# Altium schematic sheet 17 USB3 CONTROLLER.SchDoc
size 594 x 420 mm
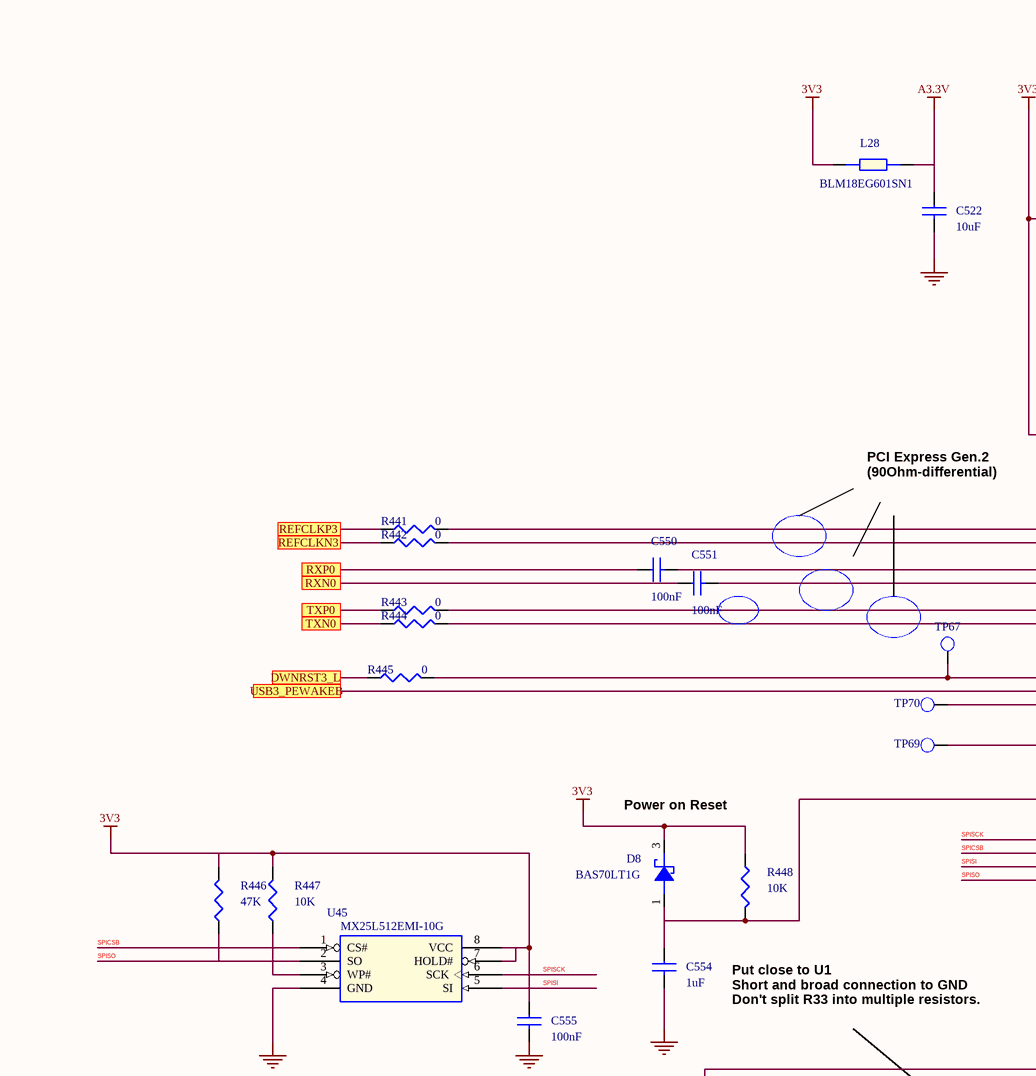
[diagram p0: 17 USB3 CONTROLLER.SchDoc, top left]
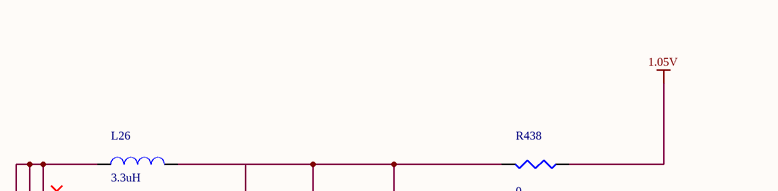
[diagram p1: 17 USB3 CONTROLLER.SchDoc, top right]
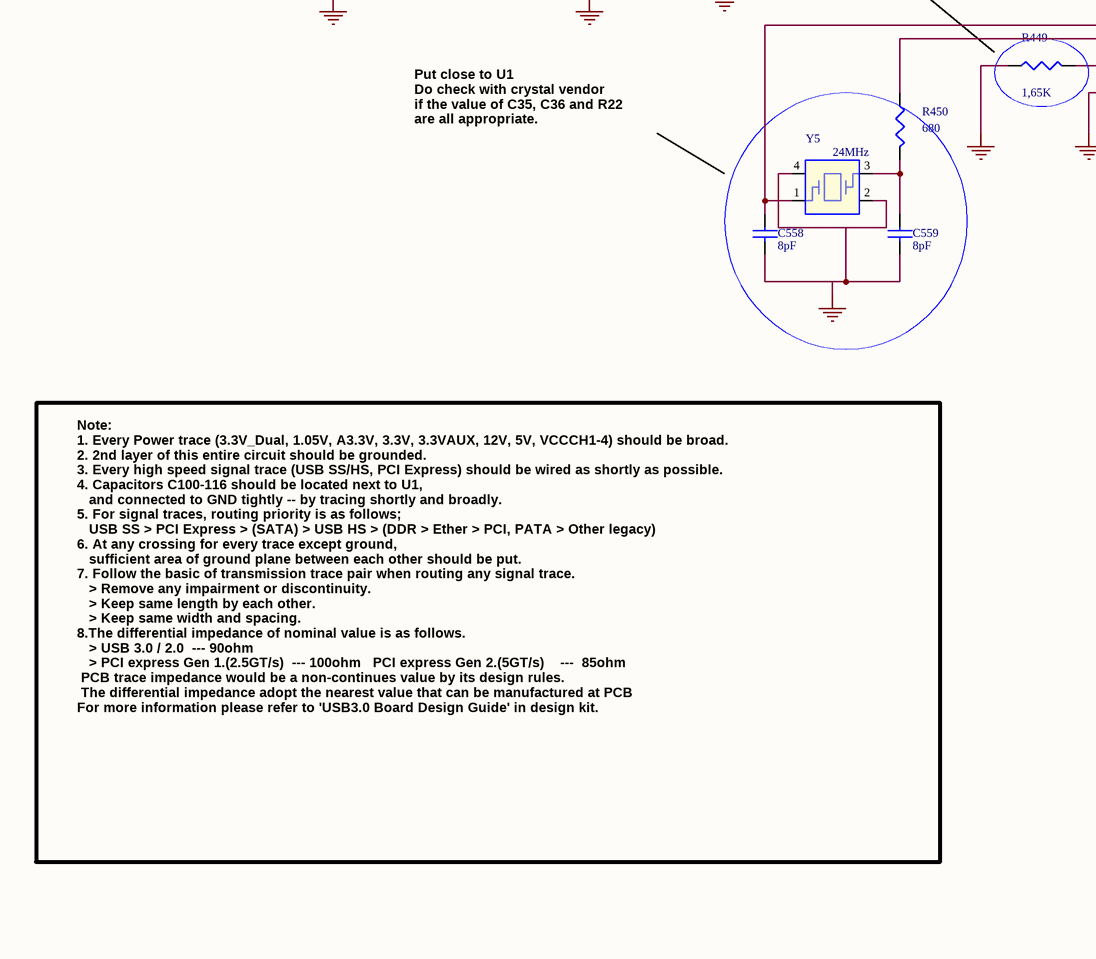
[diagram p2: 17 USB3 CONTROLLER.SchDoc, bottom left]
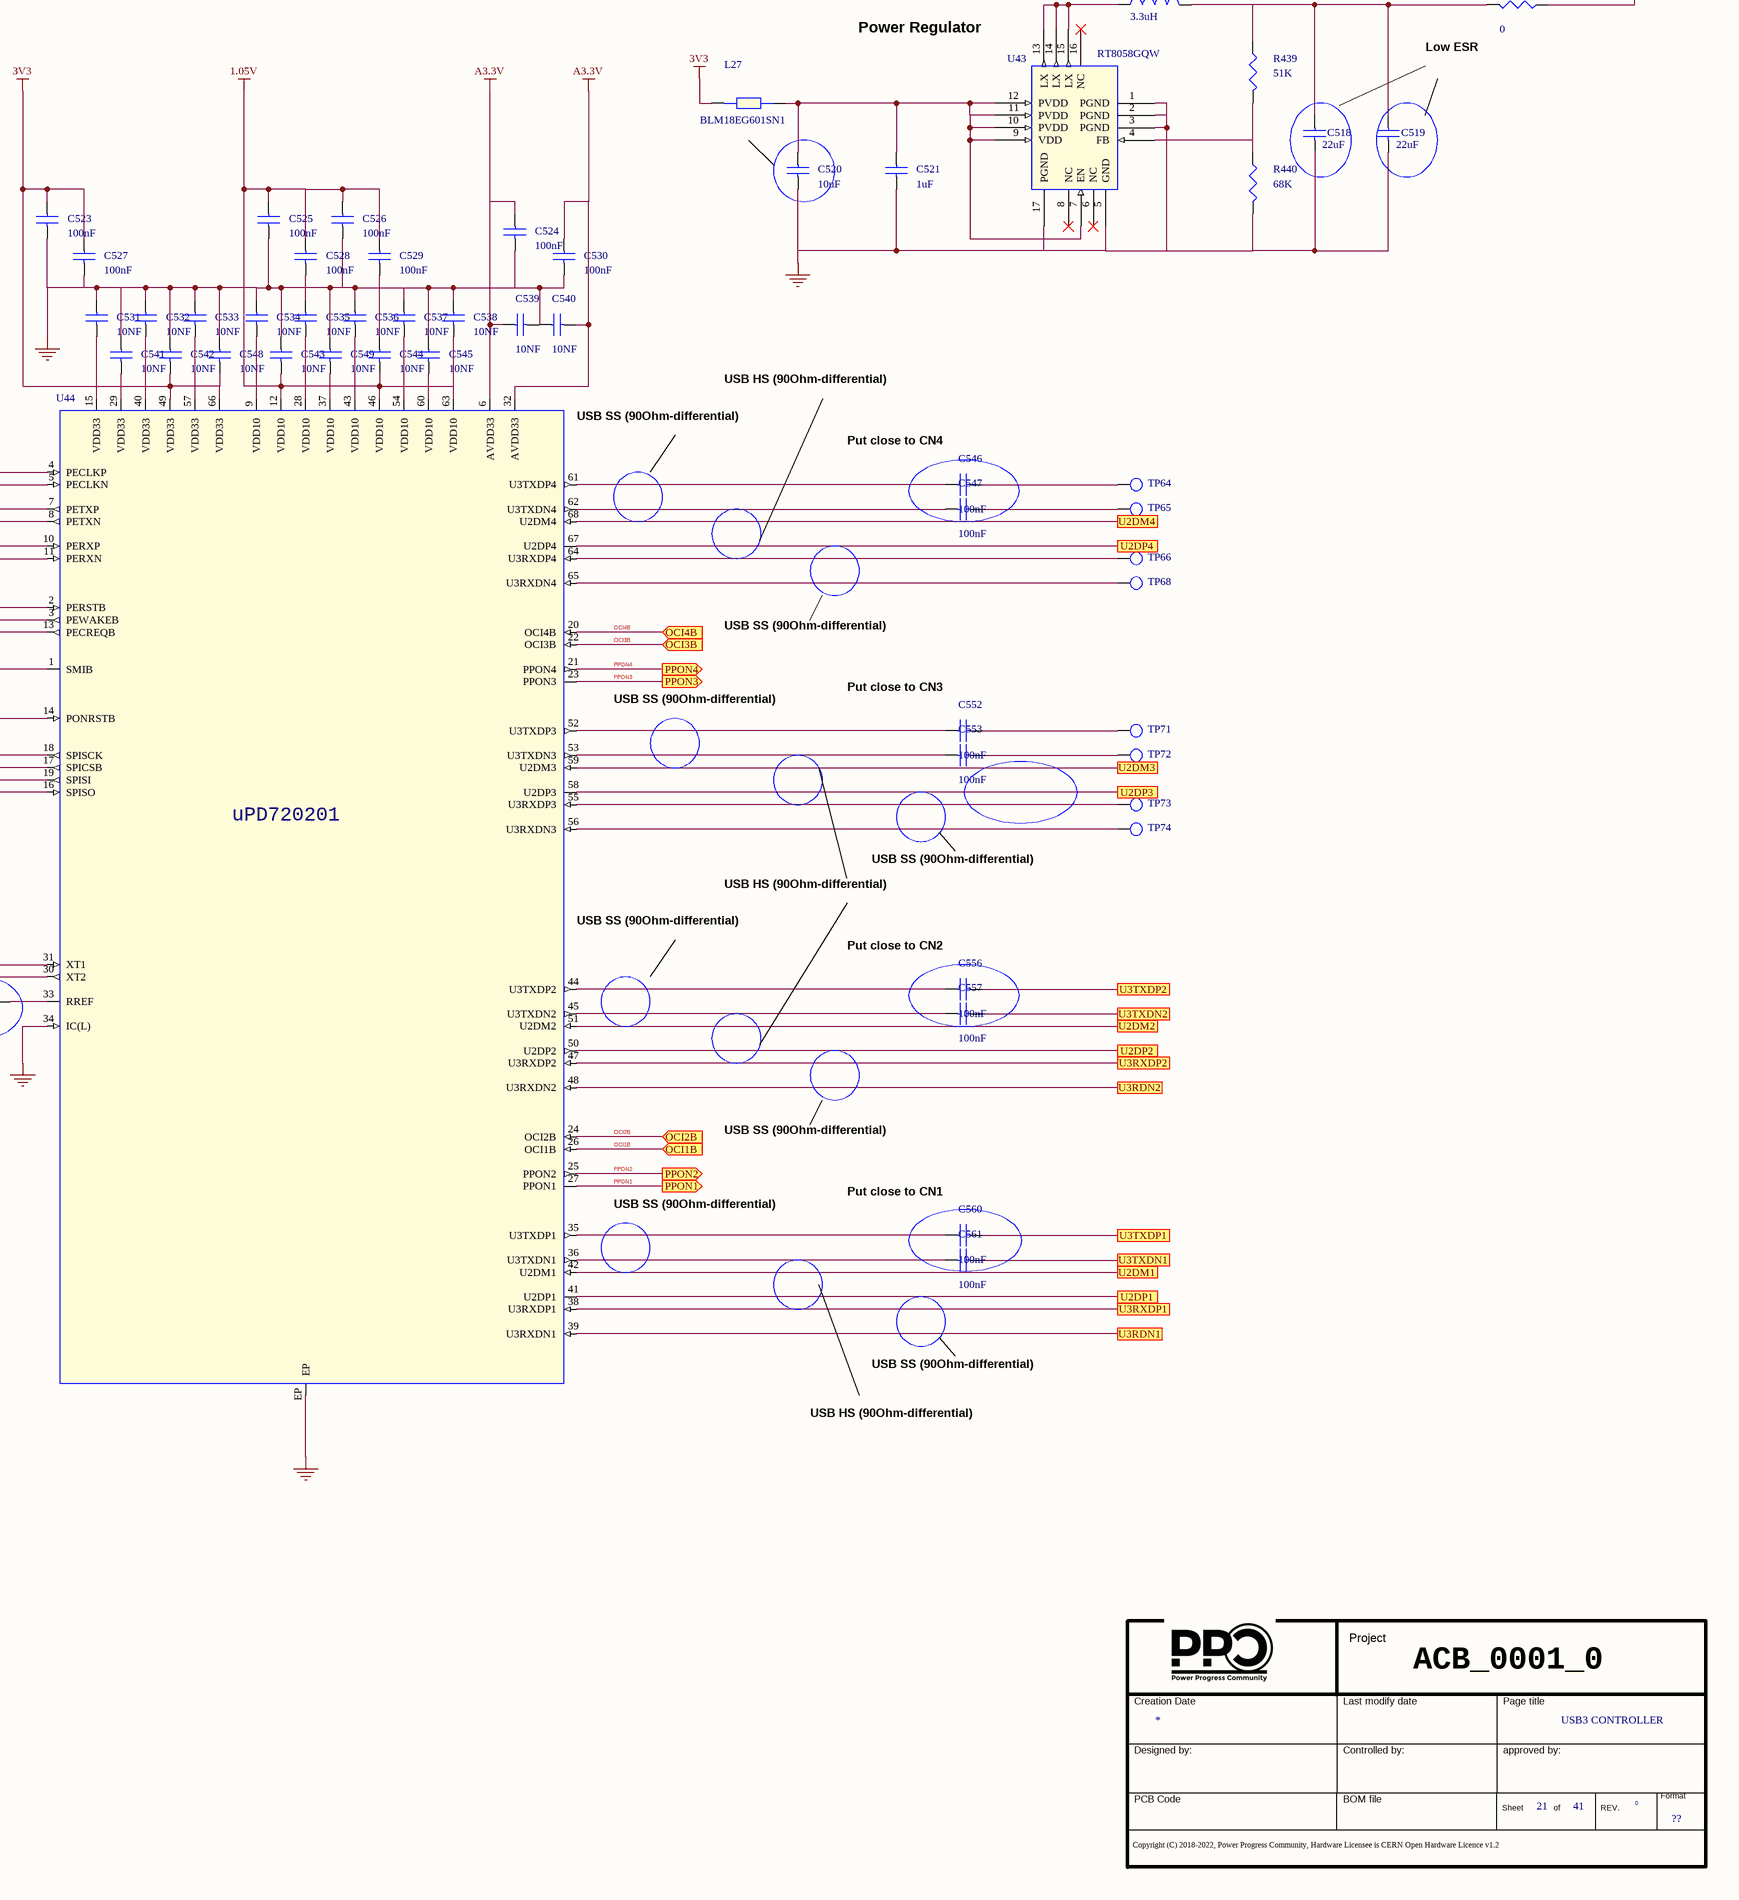
[diagram p3: 17 USB3 CONTROLLER.SchDoc, bottom right]

## Parts
*  Doc: USB3 CONTROLLER  Page Count: 41  Page Number: 21  Page Size: ??  RevCode: 0  (hidden comment: Title_block_PPC)  (graphical)
C518  22uF  [SMD_0805]
C519  22uF  [SMD_0805]
C520  10uF  [SMD_0603]
C521  1uF  [SMD_0402]
C522  10uF  [SMD_0603]
C523  100nF  [SMD_0402]
C524  100nF  [SMD_0402]
C525  100nF  [SMD_0402]
C526  100nF  [SMD_0402]
C527  100nF  [SMD_0402]
C528  100nF  [SMD_0402]
C529  100nF  [SMD_0402]
C530  100nF  [SMD_0402]
C531  10NF  [SMD_0402]
C532  10NF  [SMD_0402]
C533  10NF  [SMD_0402]
C534  10NF  [SMD_0402]
C535  10NF  [SMD_0402]
C536  10NF  [SMD_0402]
C537  10NF  [SMD_0402]
C538  10NF  [SMD_0402]
C539  10NF  [SMD_0402]
C540  10NF  [SMD_0402]
C541  10NF  [SMD_0402]
C542  10NF  [SMD_0402]
C543  10NF  [SMD_0402]
C544  10NF  [SMD_0402]
C545  10NF  [SMD_0402]
C546  100nF  [SMD_0402]
C547  100nF  [SMD_0402]
C548  10NF  [SMD_0402]
C549  10NF  [SMD_0402]
C550  100nF  [SMD_0402]
C551  100nF  [SMD_0402]
C552  100nF  [SMD_0402]
C553  100nF  [SMD_0402]
C554  1uF  [SMD_0402]
C555  100nF  [SMD_0603]
C556  100nF  [SMD_0402]
C557  100nF  [SMD_0402]
C558  8pF  [SMD_0402]
C559  8pF  [SMD_0402]
C560  100nF  [SMD_0402]
C561  100nF  [SMD_0402]
D8  BAS70LT1G  [SOT-23]
L26  3.3uH  [SMD_SRU1028]
L27  BLM18EG601SN1  [SMD_0603]
L28  BLM18EG601SN1  [SMD_0603]
R438  0  [SMD_1206]
R439  51K  [SMD_0402]
R440  68K  [SMD_0402]
R441  0  [SMD_0402]
R442  0  [SMD_0402]
R443  0  [SMD_0402]
R444  0  [SMD_0402]
R445  0  [SMD_0402]
R446  47K  [SMD_0402]
R447  10K  [SMD_0402]
R448  10K  [SMD_0402]
R449  1,65K  [SMD_0402]
R450  680  [SMD_0402]
TP64  TEST POINT  [PCB]  (value not drawn)
TP65  TEST POINT  [PCB]  (value not drawn)
TP66  TEST POINT  [PCB]  (value not drawn)
TP67  TEST POINT  [PCB]  (value not drawn)
TP68  TEST POINT  [PCB]  (value not drawn)
TP69  TEST POINT  [PCB]  (value not drawn)
TP70  TEST POINT  [PCB]  (value not drawn)
TP71  TEST POINT  [PCB]  (value not drawn)
TP72  TEST POINT  [PCB]  (value not drawn)
TP73  TEST POINT  [PCB]  (value not drawn)
TP74  TEST POINT  [PCB]  (value not drawn)
U43  RT8058GQW  [QFN16]
U44  UPD720201K8-701-BAC-A  [QFN_68]  (value not drawn)
U45  MX25L512EMI-10G  [SOP-8]
Y5  24MHz  [SMD_2.5x3.2]

## Ports
DWNRST3_L, OCI1B (in), OCI2B (in), OCI3B (in), OCI4B (in), PPON1 (out), PPON2 (out), PPON3 (out), PPON4 (out), REFCLKN3, REFCLKP3, RXN0, RXP0, TXN0, TXP0, U2DM1, U2DM2, U2DM3, U2DM4, U2DP1, U2DP2, U2DP3, U2DP4, U3RDN1, U3RDN2, U3RXDP1, U3RXDP2, U3TXDN1, U3TXDN2, U3TXDP1, U3TXDP2, USB3_PEWAKEB

## Nets
1.05V: C525.1 C526.1 C528.1 C529.1 C534.2 C535.2 C536.2 C537.2 C538.2 C543.2 C544.2 C545.2 C549.2 R438.2 U44.9(VDD10) U44.12(VDD10) U44.28(VDD10) U44.37(VDD10) U44.43(VDD10) U44.46(VDD10) U44.54(VDD10) U44.60(VDD10) U44.63(VDD10)
3V3: C523.1 C527.1 C531.2 C532.2 C533.2 C541.2 C542.2 C548.2 C555.1 D8.3(CATHODE) L27.1 L28.1 R446.2 R447.2 R448.1 U44.15(VDD33) U44.29(VDD33) U44.40(VDD33) U44.49(VDD33) U44.57(VDD33) U44.66(VDD33) U45.7(HOLD#) U45.8(VCC)
A3.3V: C522.1 C524.1 C530.1 C539.1 C540.2 L28.2 U44.6(AVDD33) U44.32(AVDD33)
GND: C518.2 C519.2 C520.2 C521.2 C522.2 C523.2 C524.2 C525.2 C526.2 C527.2 C528.2 C529.2 C530.2 C531.1 C532.1 C533.1 C534.1 C535.1 C536.1 C537.1 C538.1 C539.2 C540.1 C541.1 C542.1 C543.1 C544.1 C545.1 C548.1 C549.1 C554.2 C555.2 C558.2 C559.2 R440.1 R449.2 U43.1(PGND) U43.2(PGND) U43.3(PGND) U43.5(GND) U43.17(PGND) U44.34(IC(L)) U44.EP U45.4(GND) Y5.2 Y5.4
DWNRST3_L: R445.1 ; port DWNRST3_L
OCI1B: U44.26(OCI1B) ; port OCI1B
OCI2B: U44.24(OCI2B) ; port OCI2B
OCI3B: U44.22(OCI3B) ; port OCI3B
OCI4B: U44.20(OCI4B) ; port OCI4B
PPON1: U44.27(PPON1) ; port PPON1
PPON2: U44.25(PPON2) ; port PPON2
PPON3: U44.23(PPON3) ; port PPON3
PPON4: U44.21(PPON4) ; port PPON4
REFCLKN3: R442.1 ; port REFCLKN3
REFCLKP3: R441.1 ; port REFCLKP3
RXN0: C551.1 ; port RXN0
RXP0: C550.1 ; port RXP0
SPICSB: U44.17(SPICSB) U45.1(CS#)
SPISCK: U44.18(SPISCK) U45.6(SCK)
SPISI: U44.19(SPISI) U45.5(SI)
SPISO: R446.1 U44.16(SPISO) U45.2(SO)
TXN0: R444.1 ; port TXN0
TXP0: R443.1 ; port TXP0
U2DM1: U44.42(U2DM1) ; port U2DM1
U2DM2: U44.51(U2DM2) ; port U2DM2
U2DM3: U44.59(U2DM3) ; port U2DM3
U2DM4: U44.68(U2DM4) ; port U2DM4
U2DP1: U44.41(U2DP1) ; port U2DP1
U2DP2: U44.50(U2DP2) ; port U2DP2
U2DP3: U44.58(U2DP3) ; port U2DP3
U2DP4: U44.67(U2DP4) ; port U2DP4
U3RDN1: U44.39(U3RXDN1) ; port U3RDN1
U3RDN2: U44.48(U3RXDN2) ; port U3RDN2
U3RXDP1: U44.38(U3RXDP1) ; port U3RXDP1
U3RXDP2: U44.47(U3RXDP2) ; port U3RXDP2
U3TXDN1: C561.2 ; port U3TXDN1
U3TXDN2: C557.2 ; port U3TXDN2
U3TXDP1: C560.2 ; port U3TXDP1
U3TXDP2: C556.2 ; port U3TXDP2
USB3_PEWAKEB: U44.3(PEWAKEB) ; port USB3_PEWAKEB
NetC518_1: C518.1 C519.1 L26.2 R438.1 R439.2
NetC520_1: C520.1 C521.1 L27.2 U43.7(EN) U43.9(VDD) U43.10(PVDD) U43.11(PVDD) U43.12(PVDD)
NetC546_1: C546.1 U44.61(U3TXDP4)
NetC546_2: C546.2 TP64.1(TP)
NetC547_1: C547.1 U44.62(U3TXDN4)
NetC547_2: C547.2 TP65.1(TP)
NetC550_2: C550.2 U44.7(PETXP)
NetC551_2: C551.2 U44.8(PETXN)
NetC552_1: C552.1 U44.52(U3TXDP3)
NetC552_2: C552.2 TP71.1(TP)
NetC553_1: C553.1 U44.53(U3TXDN3)
NetC553_2: C553.2 TP72.1(TP)
NetC554_1: C554.1 D8.1(ANODE) R448.2 U44.14(PONRSTB)
NetC556_1: C556.1 U44.44(U3TXDP2)
NetC557_1: C557.1 U44.45(U3TXDN2)
NetC558_1: C558.1 U44.31(XT1) Y5.1
NetC559_1: C559.1 R450.1 Y5.3
NetC560_1: C560.1 U44.35(U3TXDP1)
NetC561_1: C561.1 U44.36(U3TXDN1)
NetL26_1: L26.1 U43.13(LX) U43.14(LX) U43.15(LX)
NetR439_1: R439.1 R440.2 U43.4(FB)
NetR441_2: R441.2 U44.4(PECLKP)
NetR442_2: R442.2 U44.5(PECLKN)
NetR443_2: R443.2 U44.10(PERXP)
NetR444_2: R444.2 U44.11(PERXN)
NetR445_2: R445.2 TP67.1(TP) U44.2(PERSTB)
NetR447_1: R447.1 U45.3(WP#)
NetR449_1: R449.1 U44.33(RREF)
NetR450_2: R450.2 U44.30(XT2)
NetTP66_1: TP66.1(TP) U44.64(U3RXDP4)
NetTP68_1: TP68.1(TP) U44.65(U3RXDN4)
NetTP69_1: TP69.1(TP) U44.1(SMIB)
NetTP70_1: TP70.1(TP) U44.13(PECREQB)
NetTP73_1: TP73.1(TP) U44.55(U3RXDP3)
NetTP74_1: TP74.1(TP) U44.56(U3RXDN3)

Not connected (* = marked no-connect by the designer): U43 6(NC)* 8(NC)* 16(NC)*

## Notes on the sheet
- Power Regulator
- (near R438) Low ESR
- (near U44) PCI Express Gen.2
  (90Ohm-differential)
- (near U44) USB SS (90Ohm-differential)
- USB HS (90Ohm-differential)
- (near C546) Put close to CN4
- USB SS (90Ohm-differential)
- Power on Reset
- (near C552) Put close to CN3
- (near U44) Put close to U1
  Short and broad connection to GND
  Don't split R33 into multiple resistors.
- (near C556) Put close to CN2
- Put close to U1
  Do check with crystal vendor
  if the value of C35, C36 and R22
  are all appropriate.
- (near C560) Put close to CN1
- Note:
  1. Every Power trace (3.3V_Dual, 1.05V, A3.3V, 3.3V, 3.3VAUX, 12V, 5V, VCCCH1-4) should be broad.
  2. 2nd layer of this entire circuit should be grounded.
  3. Every high speed signal trace (USB SS/HS, PCI Express) should be wired as shortly as possible.
  4. Capacitors C100-116 should be located next to U1,
  and connected to GND tightly -- by tracing shortly and broadly.
  5. For signal traces, routing priority is as follows;
  USB SS > PCI Express > (SATA) > USB HS > (DDR > Ether > PCI, PATA > Other legacy)
  6. At any crossing for every trace except ground,
  sufficient area of ground plane between each other should be put.
  7. Follow the basic of transmission trace pair when routing any signal trace.
  > Remove any impairment or discontinuity.
  > Keep same length by each other.
  > Keep same width and spacing.
  8.The differential impedance of nominal value is as follows.
  > USB 3.0 / 2.0  --- 90ohm
  > PCI express Gen 1.(2.5GT/s)  --- 100ohm   PCI express Gen 2.(5GT/s)    ---  85ohm
  PCB trace impedance would be a non-continues value by its design rules.
  The differential impedance adopt the nearest value that can be manufactured at PCB
  For more information please refer to 'USB3.0 Board Design Guide' in design kit.
- ACB_0001_0
- (in symbol Title_block_PPC) Project; Creation Date; Last modify date; Page title; Designed by:; Controlled by:; approved by:; Format; PCB Code; BOM file; Sheet; of; REV.; Copyright (C) 2018-2022, Power Progress Community, Hardware Licensee is CERN Open Hardware Licence v1.2
- (in symbol uPD720171_0) uPD720201

## Library data of the parts
* = Title_block_PPC: Title: T2080PCIe; Author: MICETEK; Page Create Date: March  8, 1995; Page Title: ?; Page Modify Date: *
C518 C519 = CAP NP_Dup7: 22UF 35V 20% 0805; Part Number: PASSIVE_224; Manufacturer 1: TDK; Manufacturer Part Number 1: C2012X5R1V226M125AC; RSM: RC0805; Part Type: Capacitors\Ceramic\SMD\0805; PCB Footprint: SMD_0805
C520 = CAP NP_Dup3: COND.CER.10uF 0603 25V SMD; Part Number: PASSIVE_124; Manufacturer 1: SAMSUNG; Manufacturer Part Number 1: CL10A106MA8NRNC; RSM: RC0603; Part Type: Capacitors\Ceramic\SMD\0603; PCB Footprint: SMD_0603
C521 C554 = CAP NP_Dup3: CAP CER 1UF 25V X6S 0402; Part Number: PASSIVE_1446; Manufacturer 1: Murata; Manufacturer Part Number 1: GRM155C81E105KE11D; RSM: RC0402; Part Type: Capacitors\Ceramic\SMD\0402; PCB Footprint: SMD_0402
C522 = CAP NP_Dup3: COND.CER.10uF 0603 25V SMD; Manufacturer Part Number 1: CL10A106MA8NRNC; Manufacturer 1: SAMSUNG; Part Number: PASSIVE_124; RSM: RC0603; PCB Footprint: SMD_0603; Part Type: Capacitors\Ceramic\SMD\0603
C523-C530 C546 C547 C550-C553 C556 C557 C560 C561 = CAP NP_Dup3: COND.CER. 100NF 50V 0402 X7R SMD; Manufacturer Part Number 1: CGA2B3X7R1H104M050BD; Manufacturer 1: TDK; Part Number: PASSIVE_24; RSM: RC0402; PCB Footprint: SMD_0402; Part Type: Capacitors\Ceramic\SMD\0402
C531-C545 C548 C549 = CAP NP_Dup3: COND.CER. 10NF 50V 0402 X7R SMD; Part Number: PASSIVE_29; Manufacturer 1: KEMET; Manufacturer Part Number 1: C0402C103K5RACTU; RSM: RC0402; Part Type: Capacitors\Ceramic\SMD\0402; PCB Footprint: SMD_0402
C555 = CAP NP_Dup3: COND.CER.100NF 50V 0603 X7R SMD; Manufacturer Part Number 1: ECJ1VB1H104K; Manufacturer 1: PANASONIC; Part Number: PASSIVE_118; RSM: RC0603; PCB Footprint: SMD_0603; Part Type: Capacitors\Ceramic\SMD\0603
C558 C559 = CAP NP_Dup8: CAP CER 8PF 50V C0G/NPO 0402; Manufacturer Part Number 1: CC0402DRNPO9BN8R0; Manufacturer 1: YAGEO; Part Number: PASSIVE_1461; RSM: RC0402; PCB Footprint: SMD_0402; Part Type: Capacitors\Ceramic\SMD\0402
D8 = diode_schottky_SOT23: DIODE SCHOTTKY 70V SOT23; Part Number: DISCRETE_83; Manufacturer 1: ON_SEMI; Part Type: Diodes\SCHOTTKY; Manufacturer Part Number 1: BAS70LT1G; Distributor 1: DIGIKEY (BAS70LT1GOSCT-ND); PCB Footprint: SOT-23; RSM: SOT-23
L26 = INDUCTOR_Dup1: INDUCTOR SHIELD PWR 3.3UH SMD; Part Number: PASSIVE_533; Manufacturer 1: BOURNS INC.; Manufacturer Part Number 1: SRU1028-3R3Y; RSM: IND-BOURNS-SRU1028; Part Type: Inductors\SMD\SRU1028; PCB Footprint: SMD_SRU1028
L27 L28 = FERRITE_BEAD: FERRITE BEAD 600ohm 500mA 0603 SMD; Manufacturer Part Number 1: BLM18EG601SN1 SMD; Manufacturer 1: Murata; Part Number: PASSIVE_377; RSM: RC0603; PCB Footprint: SMD_0603; Part Type: Ferrite Beads\SMD\0603
R438 = R_Dup6: RESIS. 0R 1/4W 1206 SMD E96; Part Number: PASSIVE_1266; Manufacturer 1: YAGEO; Manufacturer Part Number 1: RC1206JR-070RL; RSM: RC1206; Part Type: Resistors\Fixed\SMD\1206\5%; PCB Footprint: SMD_1206
R439 = R_Dup6: RESIS.CHIP 51K 1% 0402 SMD; Part Number: PASSIVE_752; Manufacturer 1: ROYAL OHM; RSM: RC0402; Part Type: Resistors\Fixed\SMD\0402\1%; PCB Footprint: SMD_0402; Manufacturer Part Number 1: RESIS.CHIP 51K 1% 0402 SMD
R440 = R_Dup6: RESIS.CHIP 68K 1% 0402 SMD; Manufacturer Part Number 1: RESIS.68K 1% 0402 SMD; Manufacturer 1: ROYAL OHM; Part Number: PASSIVE_1435; RSM: RC0402; PCB Footprint: SMD_0402; Part Type: Resistors\Fixed\SMD\0402\1%
R441-R445 = R_Dup6: RESIS.CHIP 0R 5% 0402 SMD; Manufacturer 1: ROYAL OHM; Part Number: PASSIVE_805; RSM: RC0402; PCB Footprint: SMD_0402; Distributor 1: CAMEL ELETTRONICA SRL  #; Manufacturer Part Number 1: RESIS.CHIP 0R 5% 0402 SMD; Part Type: Resistors\Fixed\SMD\0402\5%
R446 = R_Dup6: RESIS.CHIP 47K 1% 0402 SMD; Manufacturer 1: ROYAL OHM; Part Number: PASSIVE_737; RSM: RC0402; Manufacturer Part Number 1: RESIS.CHIP 47K 1% 0402 SMD; PCB Footprint: SMD_0402; Part Type: Resistors\Fixed\SMD\0402\1%
R447 R448 = R_Dup6: RESIS.CHIP 10K 1% 0402 SMD; Part Number: PASSIVE_584; Manufacturer 1: ROYAL OHM; RSM: RC0402; Part Type: Resistors\Fixed\SMD\0402\1%; PCB Footprint: SMD_0402; Manufacturer Part Number 1: RESIS.CHIP 10K 1% 0402 SMD
R449 = R_Dup6: RESIS.CHIP 1K65 1% 0402 SMD; Manufacturer Part Number 1: ERJ-2RKF1651X; Manufacturer 1: PANASONIC; Part Number: PASSIVE_576; RSM: RC0402; PCB Footprint: SMD_0402; Part Type: Resistors\Fixed\SMD\0402\1%
R450 = R_Dup6: RES SMD 680 OHM 1% 1/16W 0402; Manufacturer Part Number 1: RC0402FR-07680RL; Manufacturer 1: YAGEO; Part Number: PASSIVE_774; RSM: RC0402; PCB Footprint: SMD_0402; Part Type: Resistors\Fixed\SMD\0402\1%
TP64-TP74 = T POINT R_Dup1: TEST POINT SU PCB; Part Number: CONNECTORS_542; RSM: AE-TESTPOINT; Part Type: Tpoint; PCB Footprint: PCB
U43 = RT8058PQW_1: IC REG BUCK ADJUSTABLE 2A 16WQFN; Manufacturer 1: Richtek; Part Number: LINEAR_327; RSM: QFN-16-3X3-EP; Distributor 1: DIGIKEY (1028-1000-1-ND); Manufacturer Part Number 1: RT8058GQW; Part Type: Regulators\Switching; PCB Footprint: QFN16
U44 = uPD720171_0: Speed Host Controller USB 3.0 3.3V; Manufacturer 1: RENESAS; Part Number: LOGIC_352; RSM: QFN-68-EP_8X8; Distributor 1: ARROW(UPD720201K8-701-BAC-A); Manufacturer Part Number 1: UPD720201K8-701-BAC-A; Part Type: PCIE\PCIE_USB3; PCB Footprint: QFN_68
U45 = AT25640_1: IC FLASH 512K SPI 104MHZ 8SOP; Manufacturer 1: MACRONIX; Part Number: MEMORIES_104; Distributor 1: DIGIKEY(1092-1110-ND); Manufacturer Part Number 1: MX25L512EMI-10G; PCB Footprint: SOP-8; Part Type: FLASH; RSM: SOP-8
Y5 = CRYSTAL_4P: CRYSTAL 24MHZ 10PF SMD; Part Number: MISC_160; Manufacturer 1: CTS; Manufacturer Part Number 1: 403C11A24M00000; RSM: XC-CTS-632; Part Type: Quartz; Distributor 1: DIGIKEY(CTX849CT-ND); PCB Footprint: SMD_2.5x3.2